# EasyEDA schematic batery chargint PCB.json
TITLE: Sheet_1; REV: 1.0; Date: 2020-08-23; Sheet: 1/1; Company: Your Company
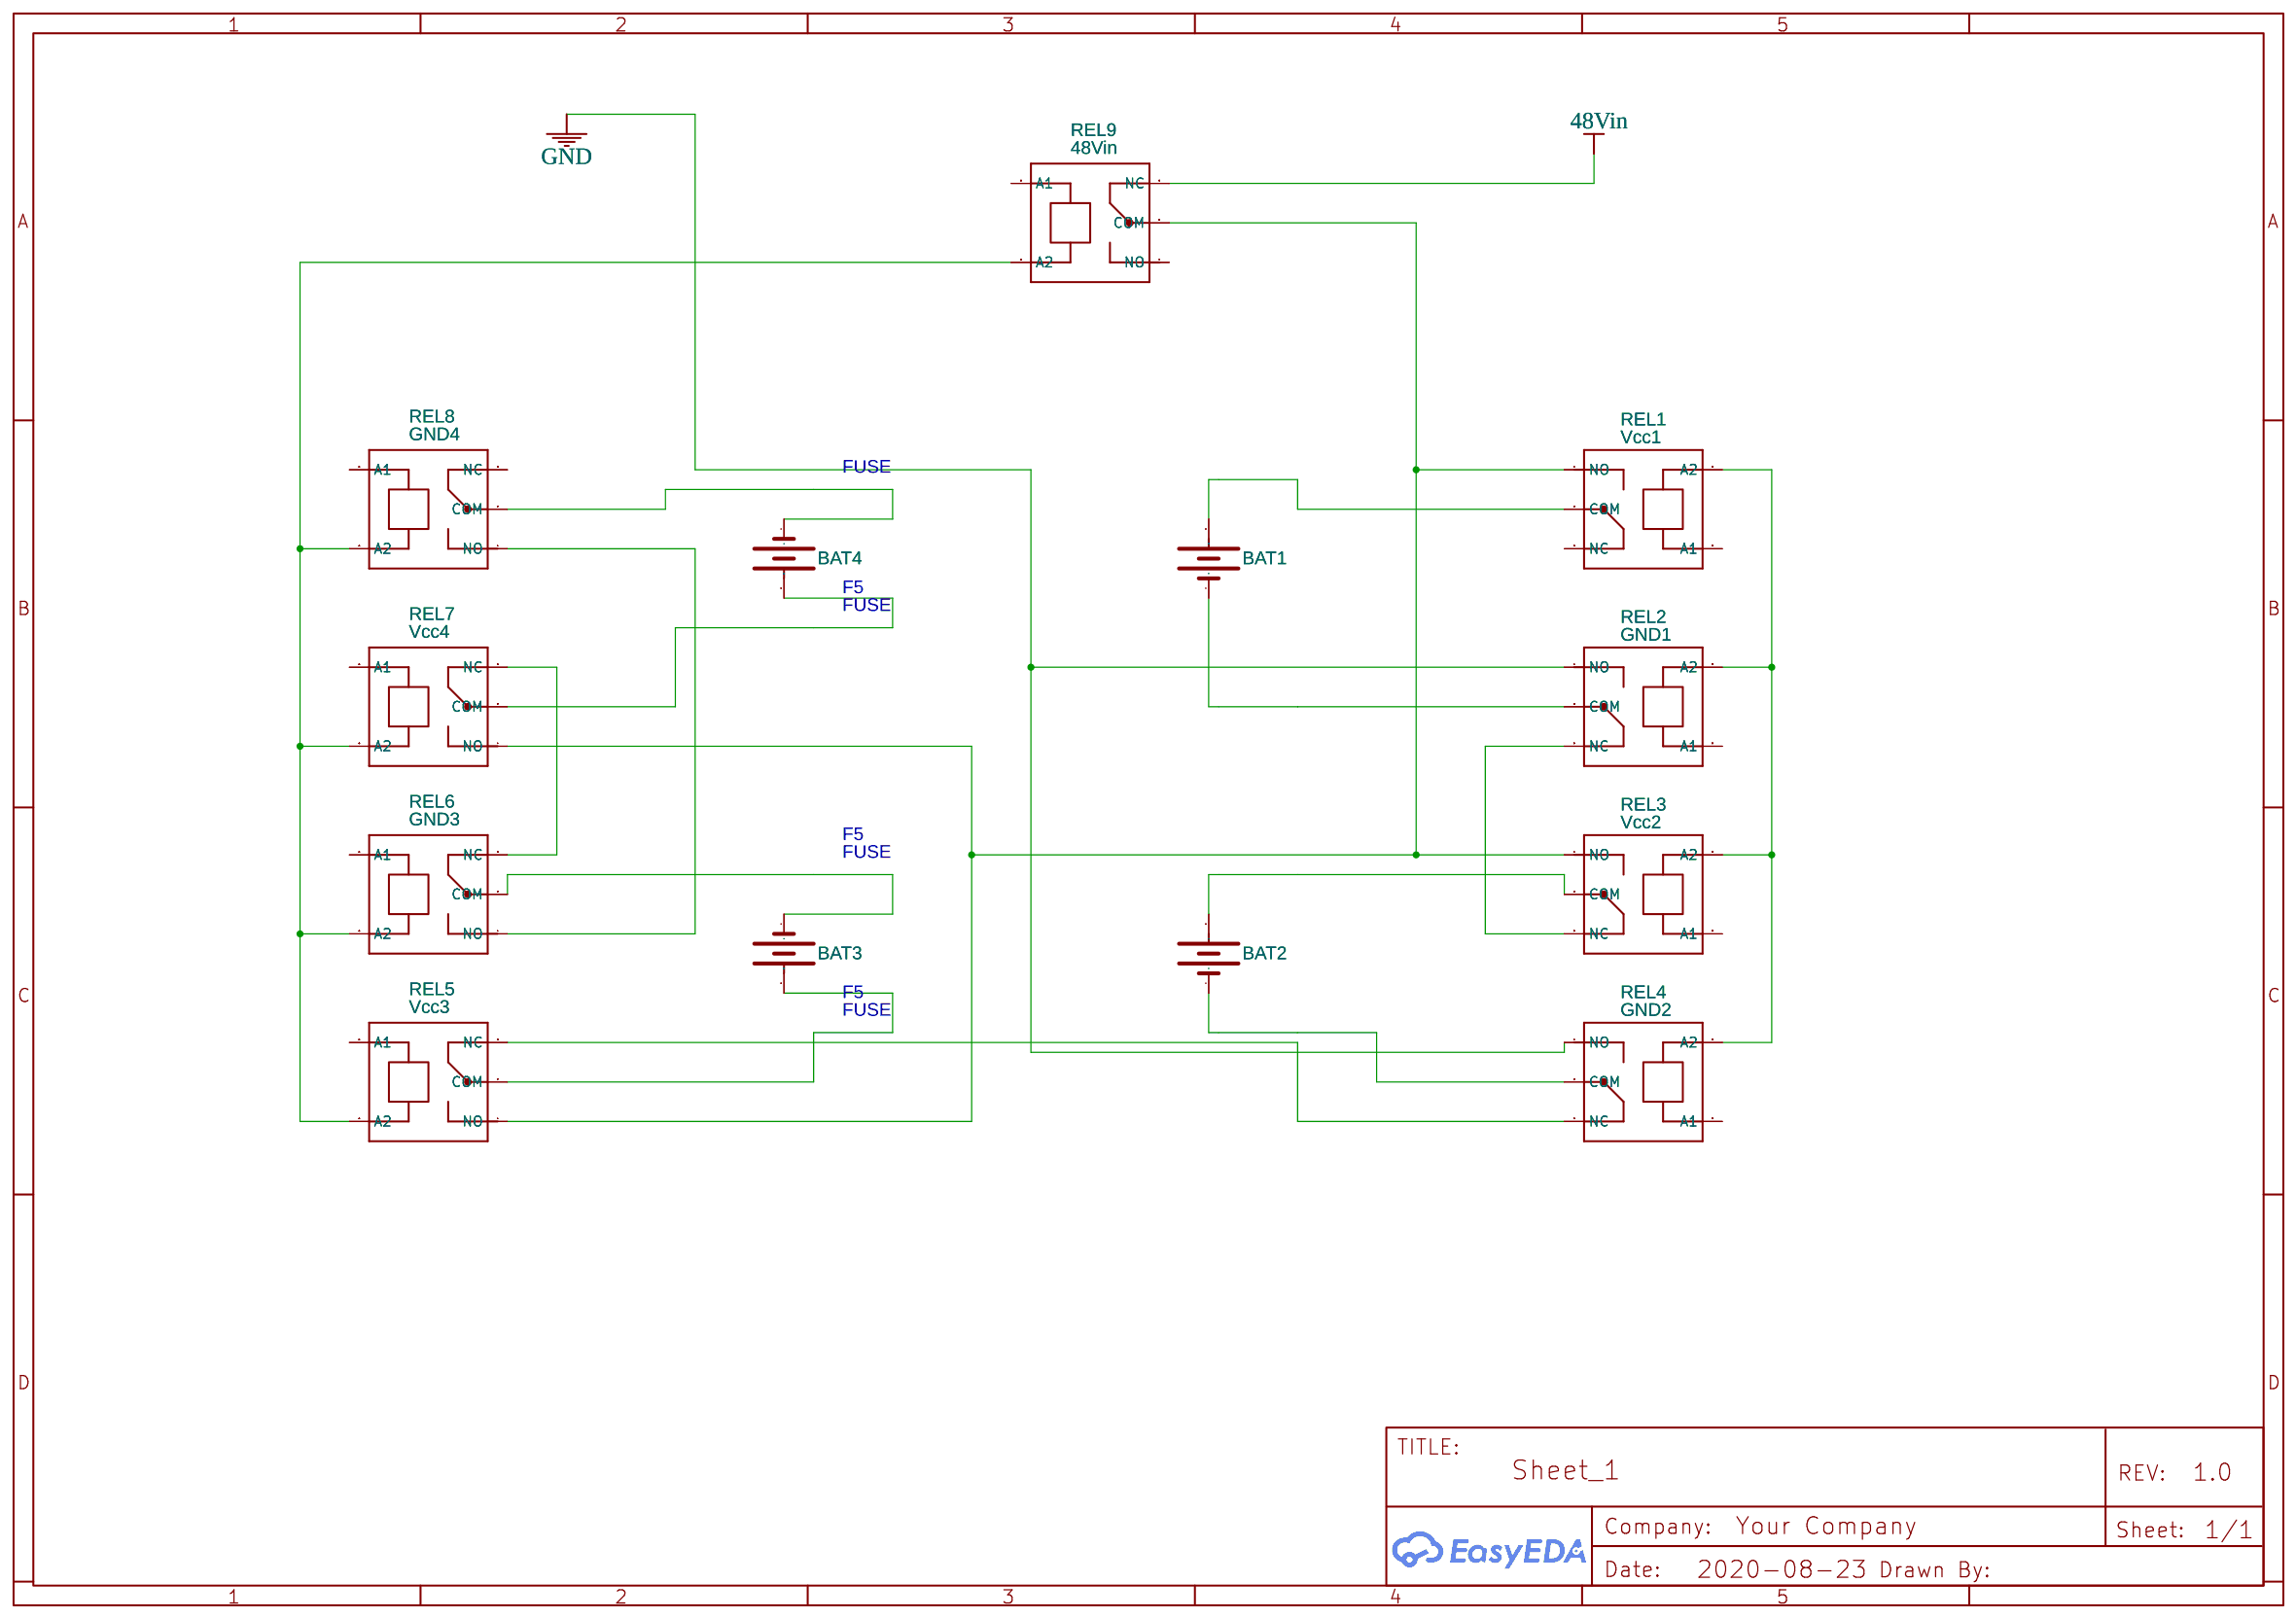
[diagram p0: schematic sheet]

## Parts
BAT1  BATTERY  [LIPO-1100MAH]
BAT2  BATTERY  [LIPO-1100MAH]
BAT3  BATTERY  [LIPO-1100MAH]
BAT4  BATTERY  [LIPO-1100MAH]
REL1  Vcc1  [PKG-36.11.9.005.4011]
REL2  GND1  [PKG-36.11.9.005.4011]
REL3  Vcc2  [PKG-36.11.9.005.4011]
REL4  GND2  [PKG-36.11.9.005.4011]
REL5  Vcc3  [PKG-36.11.9.005.4011]
REL6  GND3  [PKG-36.11.9.005.4011]
REL7  Vcc4  [PKG-36.11.9.005.4011]
REL8  GND4  [PKG-36.11.9.005.4011]
REL9  48Vin  [PKG-36.11.9.005.4011]

## Library data of the parts
BAT1-BAT4 = BATTERY: Contributor: SparkFun
REL1-REL9 = RELAY: Supplier Part: 2311438; Supplier: Element14; Manufacturer: Finder; Manufacturer Part: 36.11.9.005.4011; link: http://www.farnell.com/datasheets/2239265.pdf?_ga=2.16526389.2075366404.1513863926-238689616.1505921947&_gac=1.16049922.1513863926.EAIaIQobChMIl7zkxp6b2AIVHvEbCh1OkwhGEAAYASAAEgKMFvD_BwE; Contributor: pizzi.semmy

## Nets
48Vin: REL1.5(A2) REL2.5(A2) REL3.5(A2) REL4.5(A2) REL5.5(A2) REL6.5(A2) REL7.5(A2) REL8.5(A2) REL9.5(A2)
GND: REL2.4(NO) REL4.4(NO)
Net-(BAT1-+): BAT1.+ REL1.3(COM)
Net-(BAT1--): BAT1.- REL2.3(COM)
Net-(BAT2-+): BAT2.+ REL3.3(COM)
Net-(BAT2--): BAT2.- REL4.3(COM)
Net-(BAT3-+): BAT3.+ REL5.3(COM)
Net-(BAT3--): BAT3.- REL6.3(COM)
Net-(BAT4-+): BAT4.+ REL7.3(COM)
Net-(BAT4--): BAT4.- REL8.3(COM)
Net-(REL1-4): REL1.4(NO) REL3.4(NO) REL5.4(NO) REL7.4(NO) REL9.3(COM)
Net-(REL6-4): REL6.4(NO) REL8.4(NO)

Not connected (* = marked no-connect by the designer): REL9 4(NO)

## Notes on the sheet
- FUSE
- F5
- FUSE
- F5
- FUSE
- F5
- FUSE
